# Altium schematic sheet Main.SchDoc
size 250 x 119 mm; DocumentNumber: 6; SheetNumber: 6; SheetTotal: 11
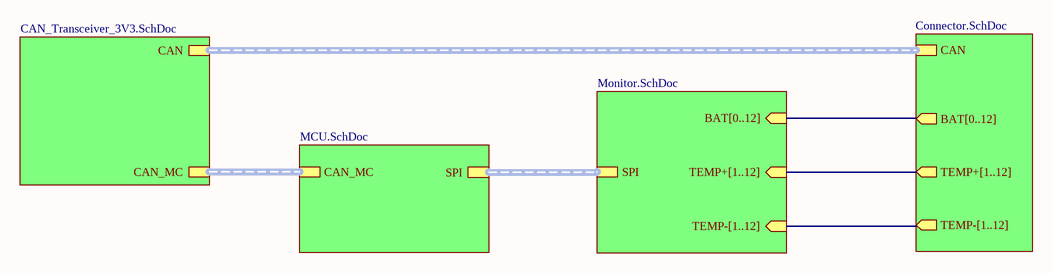
[diagram p0: Main.SchDoc]

## Sub-sheets
S2 = MCU.SchDoc: CAN_MC (harness CAN_MC), SPI (harness SPI)
S4 = Monitor.SchDoc: BAT[0..12] (in), TEMP+[1..12] (in), SPI (harness SPI), TEMP-[1..12] (in)
S9 = Connector.SchDoc: BAT[0..12] (out), TEMP+[1..12] (out), CAN (harness CAN), TEMP-[1..12] (out)
? = CAN_Transceiver_3V3.SchDoc: CAN_MC (harness CAN_MC), CAN (harness CAN)

## Buses and harness runs
bus sheet S4/BAT[0..12] = sheet S9/BAT[0..12]
bus sheet S4/TEMP+[1..12] = sheet S9/TEMP+[1..12]
bus sheet S4/TEMP-[1..12] = sheet S9/TEMP-[1..12]
harness sheet /CAN = sheet S9/CAN
harness sheet /CAN_MC = sheet S2/CAN_MC
harness sheet S2/SPI = sheet S4/SPI